# Altium schematic sheet Finger Tremor_updated1107.SchDoc
size A
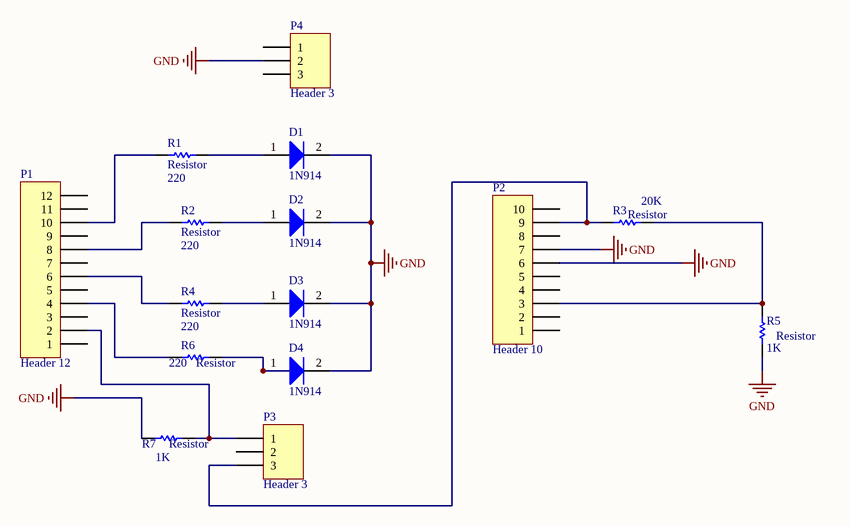
[diagram p0: Finger Tremor_updated1107.SchDoc]

## Parts
D1  1N914  [Diode]
D2  1N914  [Diode]
D3  1N914  [Diode]
D4  1N914  [Diode]
P1  Header 12  [HDR1X12]
P2  Header 10  [HDR1X10]
P3  Header 3  [HDR1X3]
P4  Header 3  [HDR1X3]
R1  Resistor  value 220  [RES]
R2  Resistor  value 220  [RES]
R3  Resistor  value 20K  [RES]
R4  Resistor  value 220  [RES]
R5  Resistor  value 1K  [RES]
R6  Resistor  value 220  [RES]
R7  Resistor  value 1K  [RES]

## Nets
GND: D1.2(K) D2.2(K) D3.2(K) D4.2(K) P2.6 P2.7 P4.2 R5.1 R7.1
NetD1_1: D1.1(A) R1.2
NetD2_1: D2.1(A) R2.2
NetD3_1: D3.1(A) R4.2
NetD4_1: D4.1(A) R6.2
NetP1_2: P1.2 P3.1 R7.2
NetP1_4: P1.4 R6.1
NetP1_6: P1.6 R4.1
NetP1_8: P1.8 R2.1
NetP1_10: P1.10 R1.1
NetP2_3: P2.3 R3.2 R5.2
NetP2_9: P2.9 P3.3 R3.1

Not connected (* = marked no-connect by the designer): P1 1 3 5 7 9 11 12; P2 1 2 4 5 8 10; P3 2; P4 1 3

## Library data of the parts
D1-D4 = 1N914: High Conductance Fast Diode
P1 = Header 12: Header, 12-Pin; LatestRevisionDate: 17-Jul-2002; LatestRevisionNote: Re-released for DXP Platform.; Publisher: Altium Limited
P2 = Header 10: Header, 10-Pin; LatestRevisionDate: 17-Jul-2002; LatestRevisionNote: Re-released for DXP Platform.; Publisher: Altium Limited
P3 P4 = Header 3: Header, 3-Pin; LatestRevisionDate: 17-Jul-2002; LatestRevisionNote: Re-released for DXP Platform.; Publisher: Altium Limited